# Altium schematic sheet Sheet1.SchDoc
size A4
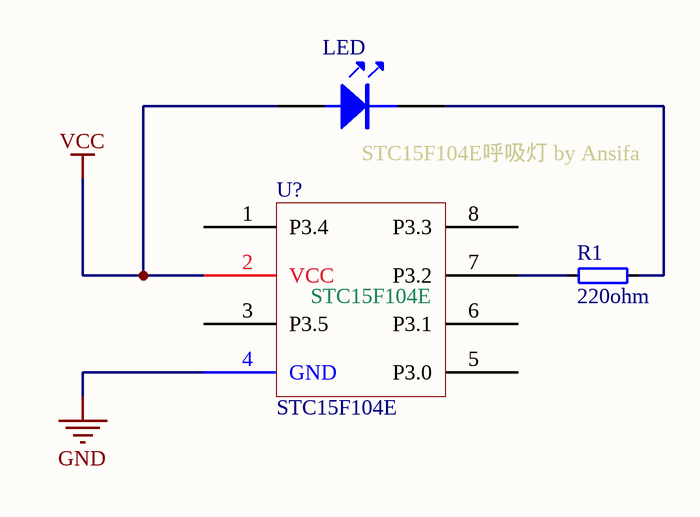
[diagram p0: Sheet1.SchDoc]

## Parts
LED  发光二极管  [DIODE0.4A]  (value not drawn)
R1  220ohm  [AXIAL0.3]
U?  STC15F104E  [DIP8]

## Nets
GND: U?.4(GND)
VCC: LED.A U?.2(VCC)
NetLED_K: LED.K R1.2
NetR1_1: R1.1 U?.7(P3.2)

Not connected (* = marked no-connect by the designer): U? 1(P3.4) 3(P3.5) 5(P3.0) 6(P3.1) 8(P3.3)

## Notes on the sheet
- STC15F104E呼吸灯 by Ansifa

## Library data of the parts
R1 = RES